# Altium schematic sheet control_2.SchDoc
size A4
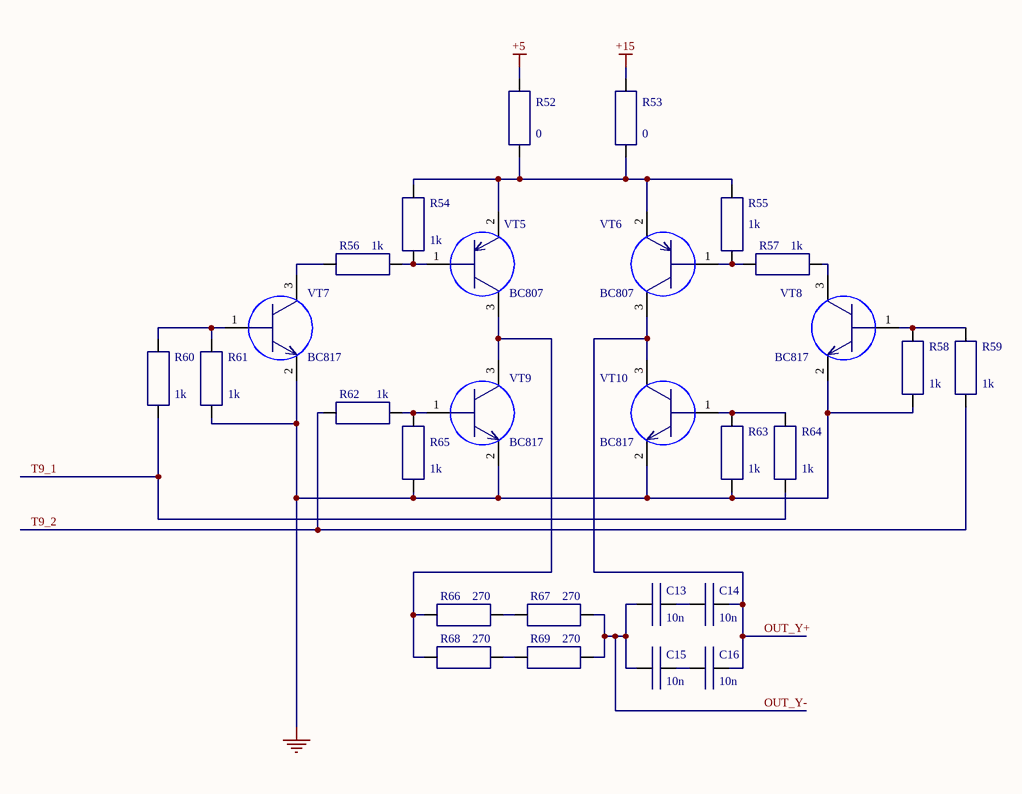
[diagram p0: control_2.SchDoc]

## Parts
C13  10n  [C0805]
C14  10n  [C0805]
C15  10n  [C0805]
C16  10n  [C0805]
R52  0  [R1206]
R53  0  [R1206]
R54  1k  [R0805]
R55  1k  [R0805]
R56  1k  [R0805]
R57  1k  [R0805]
R58  1k  [R0805]
R59  1k  [R0805]
R60  1k  [R0805]
R61  1k  [R0805]
R62  1k  [R0805]
R63  1k  [R0805]
R64  1k  [R0805]
R65  1k  [R0805]
R66  270  [R1206]
R67  270  [R1206]
R68  270  [R1206]
R69  270  [R1206]
VT5  BC807  [SOT-23]
VT6  BC807  [SOT-23]
VT7  BC817  [SOT-23]
VT8  BC817  [SOT-23]
VT9  BC817  [SOT-23]
VT10  BC817  [SOT-23]

## Nets
+5: R52.2
+15: R53.2
GND: R58.1 R61.1 R63.1 R65.1 VT7.2 VT8.2 VT9.2 VT10.2
OUT_Y+: C14.1 C16.1 VT6.3 VT10.3
OUT_Y-: C13.2 C15.2 R67.1 R69.1
T9_1: R60.1 R64.1
T9_2: R59.1 R62.2
NetC13_1: C13.1 C14.2
NetC15_1: C15.1 C16.2
NetR52_1: R52.1 R53.1 R54.2 R55.2 VT5.2 VT6.2
NetR54_1: R54.1 R56.1 VT5.1
NetR55_1: R55.1 R57.2 VT6.1
NetR56_2: R56.2 VT7.3
NetR57_1: R57.1 VT8.3
NetR58_2: R58.2 R59.2 VT8.1
NetR60_2: R60.2 R61.2 VT7.1
NetR62_1: R62.1 R65.2 VT9.1
NetR63_2: R63.2 R64.2 VT10.1
NetR66_1: R66.1 R67.2
NetR66_2: R66.2 R68.2 VT5.3 VT9.3
NetR68_1: R68.1 R69.2

## Library data of the parts
C13-C16 = C0805
R52 R53 R66-R69 = R1206
R54-R65 = R0805
VT5 VT6 = PNP
VT7-VT10 = NPN